# Altium schematic sheet mcu.SchDoc
size A3
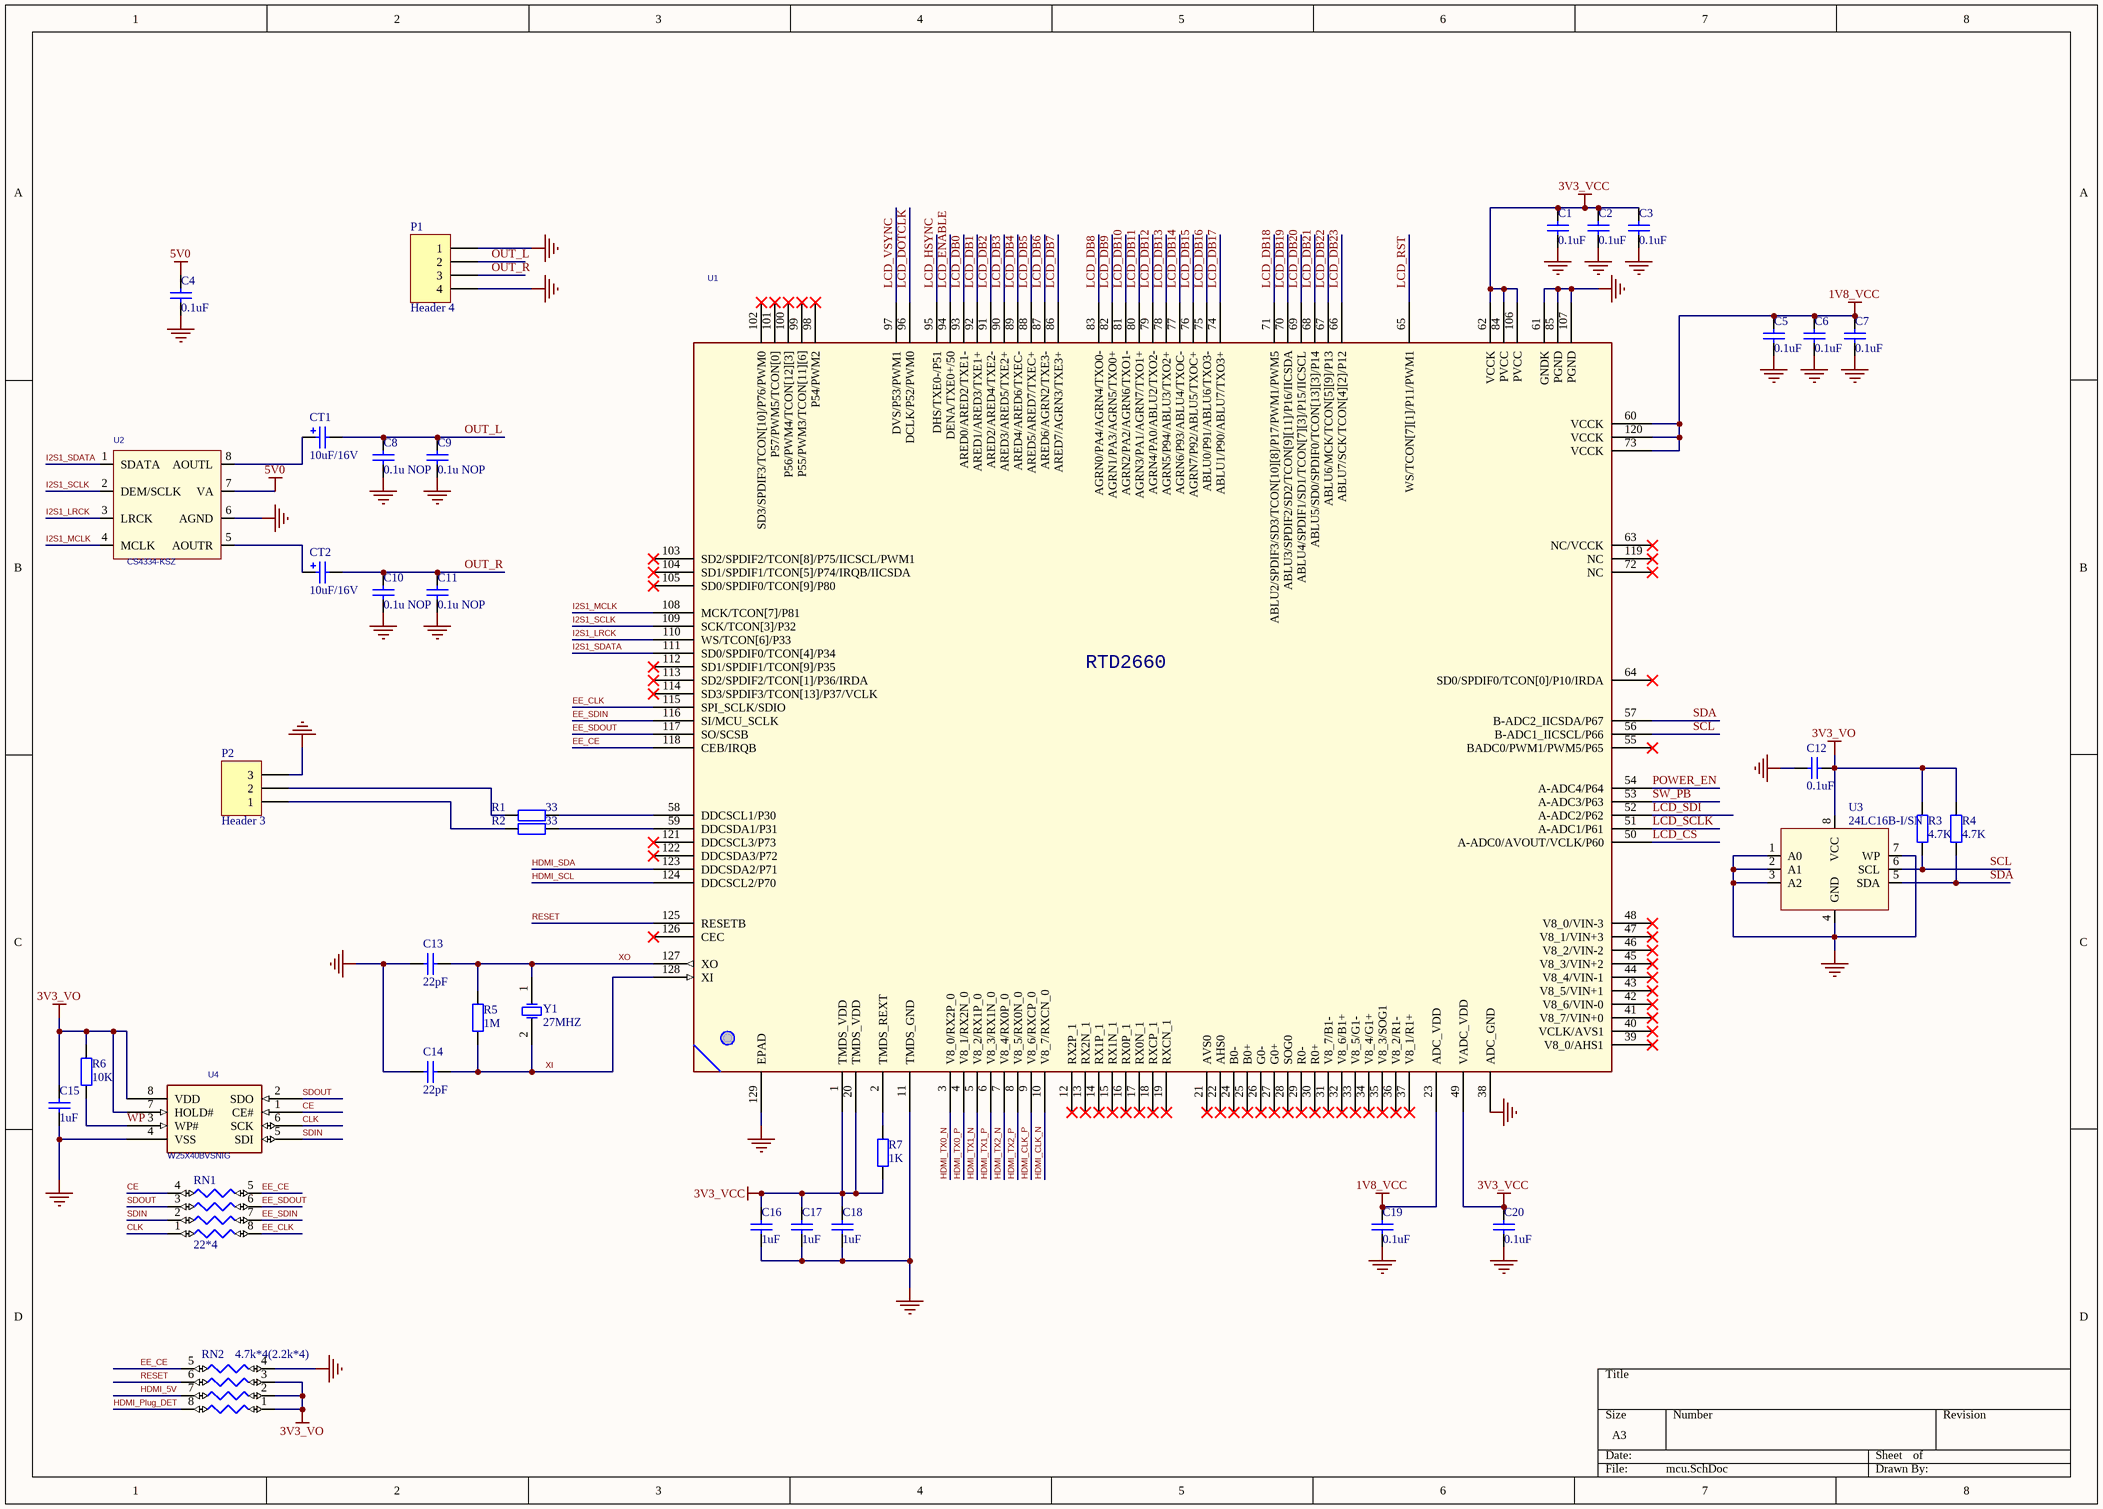
[diagram p0: mcu.SchDoc]

## Parts
C1  0.1uF  [0603S-CAP]
C2  0.1uF  [0603S-CAP]
C3  0.1uF  [0603S-CAP]
C4  0.1uF  [0603S-CAP]
C5  0.1uF  [0603S-CAP]
C6  0.1uF  [0603S-CAP]
C7  0.1uF  [0603S-CAP]
C8  0.1u NOP  [0603S-CAP]
C9  0.1u NOP  [0603S-CAP]
C10  0.1u NOP  [0603S-CAP]
C11  0.1u NOP  [0603S-CAP]
C12  0.1uF  [0603S-CAP]
C13  22pF  [0603S-CAP]
C14  22pF  [0603S-CAP]
C15  1uF  [0603S-CAP]
C16  1uF  [0603S-CAP]
C17  1uF  [0603S-CAP]
C18  1uF  [0603S-CAP]
C19  0.1uF  [0603S-CAP]
C20  0.1uF  [0603S-CAP]
CT1  10uF/16V  [钽电容（A型）]
CT2  10uF/16V  [钽电容（A型）]
P1  Header 4  [PJ-342]
P2  Header 3  [smt1X3]
R1  33  [0603S-RES]
R2  33  [0603S-RES]
R3  4.7K  [0603S-RES]
R4  4.7K  [0603S-RES]
R5  1M  [0603S-RES]
R6  10K  [0603S-RES]
R7  1K  [0603S-RES]
RN1  22*4  [NC06-4]
RN2  4.7k*4(2.2k*4)  [NC06-4]
U1  RTD2660H  [LQFP128_P0_5_22X16_EPAD]  (value not drawn)
U2  CS4334-KSZ  [SOIC-8N]
U3  24LC16B-I/SN  [SOIC-8N]
U4  W25X40BVSNIG  [SOIC-8N]
Y1  27MHZ  [XTAL-SMT]

## Nets
1V8_VCC: C5.2 C6.2 C7.2 C19.2 U1.23(ADC_VDD) U1.60(VCCK) U1.73(VCCK) U1.120(VCCK)
3V3_VCC: C1.2 C2.2 C3.2 C16.2 C17.2 C18.2 C20.2 R7.1 U1.1(TMDS_VDD) U1.20(TMDS_VDD) U1.49(VADC_VDD) U1.62(VCCK) U1.84(PVCC) U1.106(PVCC)
3V3_VO: C12.2 C15.2 R3.2 R4.2 R6.2 RN2.1 RN2.2 RN2.3 U3.8(VCC) U4.7(HOLD#) U4.8(VDD)
5V0: C4.2 U2.7(VA)
GND: C1.1 C2.1 C3.1 C4.1 C5.1 C6.1 C7.1 C8.1 C9.1 C10.1 C11.1 C12.1 C13.2 C14.2 C15.1 C16.1 C17.1 C18.1 C19.1 C20.1 P1.1 P1.4 P2.3 RN2.4 U1.11(TMDS_GND) U1.38(ADC_GND) U1.61(GNDK) U1.85(PGND) U1.107(PGND) U1.129(EPAD) U2.6(AGND) U3.1(A0) U3.2(A1) U3.3(A2) U3.4(GND) U3.7(WP) U4.4(VSS)
CE: RN1.4 U4.1(CE#)
CLK: RN1.1 U4.6(SCK)
EE_CE: RN1.5 RN2.5 U1.118(CEB/IRQB)
EE_CLK: RN1.8 U1.115(SPI_SCLK/SDIO)
EE_SDIN: RN1.7 U1.116(SI/MCU_SCLK)
EE_SDOUT: RN1.6 U1.117(SO/SCSB)
HDMI_5V: RN2.7
HDMI_CLK_N: U1.10(V8_7/RXCN_0)
HDMI_CLK_P: U1.9(V8_6/RXCP_0)
HDMI_Plug_DET: RN2.8
HDMI_SCL: U1.124(DDCSCL2/P70)
HDMI_SDA: U1.123(DDCSDA2/P71)
HDMI_TX0_N: U1.3(V8_0/RX2P_0)
HDMI_TX0_P: U1.4(V8_1/RX2N_0)
HDMI_TX1_N: U1.5(V8_2/RX1P_0)
HDMI_TX1_P: U1.6(V8_3/RX1N_0)
HDMI_TX2_N: U1.7(V8_4/RX0P_0)
HDMI_TX2_P: U1.8(V8_5/RX0N_0)
I2S1_LRCK: U1.110(WS/TCON[6]/P33) U2.3(LRCK)
I2S1_MCLK: U1.108(MCK/TCON[7]/P81) U2.4(MCLK)
I2S1_SCLK: U1.109(SCK/TCON[3]/P32) U2.2(DEM/SCLK)
I2S1_SDATA: U1.111(SD0/SPDIF0/TCON[4]/P34) U2.1(SDATA)
LCD_CS: U1.50(A-ADC0/AVOUT/VCLK/P60)
LCD_DB0: U1.93(ARED0/ARED2/TXE1-)
LCD_DB1: U1.92(ARED1/ARED3/TXE1+)
LCD_DB2: U1.91(ARED2/ARED4/TXE2-)
LCD_DB3: U1.90(ARED3/ARED5/TXE2+)
LCD_DB4: U1.89(ARED4/ARED6/TXEC-)
LCD_DB5: U1.88(ARED5/ARED7/TXEC+)
LCD_DB6: U1.87(ARED6/AGRN2/TXE3-)
LCD_DB7: U1.86(ARED7/AGRN3/TXE3+)
LCD_DB8: U1.83(AGRN0/PA4/AGRN4/TXO0-)
LCD_DB9: U1.82(AGRN1/PA3/AGRN5/TXO0+)
LCD_DB10: U1.81(AGRN2/PA2/AGRN6/TXO1-)
LCD_DB11: U1.80(AGRN3/PA1/AGRN7/TXO1+)
LCD_DB12: U1.79(AGRN4/PA0/ABLU2/TXO2-)
LCD_DB13: U1.78(AGRN5/P94/ABLU3/TXO2+)
LCD_DB14: U1.77(AGRN6/P93/ABLU4/TXOC-)
LCD_DB15: U1.76(AGRN7/P92/ABLU5/TXOC+)
LCD_DB16: U1.75(ABLU0/P91/ABLU6/TXO3-)
LCD_DB17: U1.74(ABLU1/P90/ABLU7/TXO3+)
LCD_DB18: U1.71(ABLU2/SPDIF3/SD3/TCON[10][8]/P17/PWM1/PWM5)
LCD_DB19: U1.70(ABLU3/SPDIF2/SD2/TCON[9][11]/P16/IICSDA)
LCD_DB20: U1.69(ABLU4/SPDIF1/SD1/TCON[7][3]/P15/IICSCL)
LCD_DB21: U1.68(ABLU5/SD0/SPDIF0/TCON[13][3]/P14)
LCD_DB22: U1.67(ABLU6/MCK/TCON[5][9]/P13)
LCD_DB23: U1.66(ABLU7/SCK/TCON[4][2]/P12)
LCD_DOTCLK: U1.96(DCLK/P52/PWM0)
LCD_ENABLE: U1.94(DENA/TXE0+/50)
LCD_HSYNC: U1.95(DHS/TXE0-/P51)
LCD_RST: U1.65(WS/TCON[7][1]/P11/PWM1)
LCD_SCLK: U1.51(A-ADC1/P61)
LCD_SDI: U1.52(A-ADC2/P62)
LCD_VSYNC: U1.97(DVS/P53/PWM1)
OUT_L: C8.2 C9.2 CT1.2 P1.2
OUT_R: C10.2 C11.2 CT2.2 P1.3
POWER_EN: U1.54(A-ADC4/P64)
RESET: RN2.6 U1.125(RESETB)
SCL: R3.1 U1.56(B-ADC1_IICSCL/P66) U3.6(SCL)
SDA: R4.1 U1.57(B-ADC2_IICSDA/P67) U3.5(SDA)
SDIN: RN1.2 U4.5(SDI)
SDOUT: RN1.3 U4.2(SDO)
SW_PB: U1.53(A-ADC3/P63)
WP: R6.1 U4.3(WP#)
XI: C14.1 R5.1 U1.128(XI) Y1.2(OSC2)
XO: C13.1 R5.2 U1.127(XO) Y1.1(OSC1)
NetCT1_1: CT1.1 U2.8(AOUTL)
NetCT2_1: CT2.1 U2.5(AOUTR)
NetP2_1: P2.1 R2.2
NetP2_2: P2.2 R1.2
NetR1_1: R1.1 U1.58(DDCSCL1/P30)
NetR2_1: R2.1 U1.59(DDCSDA1/P31)
NetR7_2: R7.2 U1.2(TMDS_REXT)

Not connected (* = marked no-connect by the designer): U1 12(RX2P_1)* 13(RX2N_1)* 14(RX1P_1)* 15(RX1N_1)* 16(RX0P_1)* 17(RX0N_1)* 18(RXCP_1)* 19(RXCN_1)* 21(AVS0)* 22(AHS0)* 24(B0-)* 25(B0+)* 26(G0-)* 27(G0+)* 28(SOG0)* 29(R0-)* 30(R0+)* 31(V8_7/B1-)* 32(V8_6/B1+)* 33(V8_5/G1-)* 34(V8_4/G1+)* 35(V8_3/SOG1)* 36(V8_2/R1-)* 37(V8_1/R1+)* 39(V8_0/AHS1)* 40(VCLK/AVS1)* 41(V8_7/VIN+0)* 42(V8_6/VIN-0)* 43(V8_5/VIN+1)* 44(V8_4/VIN-1)* 45(V8_3/VIN+2)* 46(V8_2/VIN-2)* 47(V8_1/VIN+3)* 48(V8_0/VIN-3)* 55(BADC0/PWM1/PWM5/P65)* 63(NC/VCCK)* 64(SD0/SPDIF0/TCON[0]/P10/IRDA)* 72(NC)* 98(P54/PWM2)* 99(P55/PWM3/TCON[11][6])* 100(P56/PWM4/TCON[12][3])* 101(P57/PWM5/TCON[0])* 102(SD3/SPDIF3/TCON[10]/P76/PWM0)* 103(SD2/SPDIF2/TCON[8]/P75/IICSCL/PWM1)* 104(SD1/SPDIF1/TCON[5]/P74/IRQB/IICSDA)* 105(SD0/SPDIF0/TCON[9]/P80)* 112(SD1/SPDIF1/TCON[9]/P35)* 113(SD2/SPDIF2/TCON[1]/P36/IRDA)* 114(SD3/SPDIF3/TCON[13]/P37/VCLK)* 119(NC)* 121(DDCSCL3/P73)* 122(DDCSDA3/P72)* 126(CEC)*

## Notes on the sheet
- (in symbol RTD2523_10) RTD2660

## Library data of the parts
C1-C11 C13-C20 = Cap: 50V/8.2u/0805; Value: 100n; Published: 8-Jun-2000; LatestRevisionDate: 17-Jul-2002; LatestRevisionNote: Re-released for DXP Platform.; PackageReference: RAD-0.3; Publisher: Altium Limited
C12 = CAP SMT 0.1uF 16V X7R: 2. Manufacturere Part Number: C0805C104K4RACTU; 1. Manufacturer: Kemet; 8. Alternate Part: any; 7. Package / Case: 0805; 6. Mounting Type: SMT; 5. Supplier Link: http://www.digikey.com/product-detail/en/C0805C104K4RACTU/399-1167-1-ND/411442; 3. Supplier: Digi-Key; 4. Supplier Part Number: 399-1167-1-ND
CT1 CT2 = Cap Pol2: Polarized Capacitor (Axial); Value: 100pF; Published: 8-Jun-2000; LatestRevisionDate: 17-Jul-2002; LatestRevisionNote: Re-released for DXP Platform.; PackageReference: POLAR0.8; Publisher: Altium Limited
P1 = Header 4: Header, 4-Pin; LatestRevisionDate: 17-Jul-2002; LatestRevisionNote: Re-released for DXP Platform.; Publisher: Altium Limited
P2 = Header 3: Header, 3-Pin; LatestRevisionDate: 17-Jul-2002; LatestRevisionNote: Re-released for DXP Platform.; Publisher: Altium Limited
R1 R2 R5-R7 = Res2: Resistor; Value: 49.9; Published: 8-Jun-2000; LatestRevisionDate: 17-Jul-2002; LatestRevisionNote: Re-released for DXP Platform.; PackageReference: AXIAL-0.4; Publisher: Altium Limited
R3 R4 = Res2: Resistor; Value: 10K; Published: 8-Jun-2000; LatestRevisionDate: 17-Jul-2002; LatestRevisionNote: Re-released for DXP Platform.; PackageReference: AXIAL-0.4; Publisher: Altium Limited
RN1 RN2 = RN4: Option 2 - Device: *; Option 2 - Spec: *; Option 3 - Device: *; Option 3 - Spec: *; Option 4 - Device: *; Option 4 - Spec: *; Option 5 - Device: *; Option 5 - Spec: *; Option 6 - Device: *; Option 6 - Spec: *; Option 7 - Device: *; Option 7 - Spec: *; Option 8 - Device: *; Option 8 - Spec: *
U1 = RTD2523_10: Part Number: 21-D004978
U2 = CS4334-KSZ: Part Number: 19-D005021
U3 = 24LC64-I/SN: IC EEPROM 64KBIT 400KHZ 8SOIC; Manufacturer: Microchip Technology; Format - Memory: EEPROMs - Serial; Memory Size: 64K (8K x 8); Interface: I2C, 2-Wire Serial; Voltage - Supply: 2.5 V ~ 5.5 V; Supplier 1: Digi-Key; Manufacturer Part Number: 24LC64-I/SN; RoHS: RoHS Compliant; Category: Integrated Circuits (ICs); Stock 1: 16323; Pricing 1: 1=0.38, 25=0.37, 100=0.35 (USD); Packaging: Tube; Memory Type: EEPROM; Speed: 400kHz; Operating Temperature: -40°C ~ 85°C (TA); Package / Case: 8-SOIC (0.154", 3.90mm Width); Supplier Device Package: 8-SOIC; ComponentLink1URL: http://www.microchip.com/mymicrochip/filehandler.aspx?ddocname=en011843; ComponentLink1Description: http://www.microchip.com/mymicrochip/filehandler.aspx?ddocname=en011843; Supplier Part Number 1: 24LC64-I/SN-ND
U4 = 24C08_1: part number: 19-D004782
Y1 = XTAL 32.768KHZ: Crystal, CRYSTAL 32.768KHZ 6PF SMD; 2. Manufacturere Part Number: ABS07-120-32.768KHZ-T; 1. Manufacturer: Abracon; 6. Mounting Type: SMT; 9. Notes: 2 pad - Abracon ABS07-120-32.768KHZ-T, 4 pad - Abracon ABS25-32.768KHZ-6-T; 0. Do Not Install: DNI; 5. Supplier Link: http://www.digikey.com/product-detail/en/ABS07-120-32.768KHZ-T/535-11937-1-ND/3724046; 3. Supplier: Digi-Key; 4. Supplier Part Number: 535-11937-1-ND